# EAGLE design Sensor_LED_2x6_PCB (EAGLE 7.6.0)
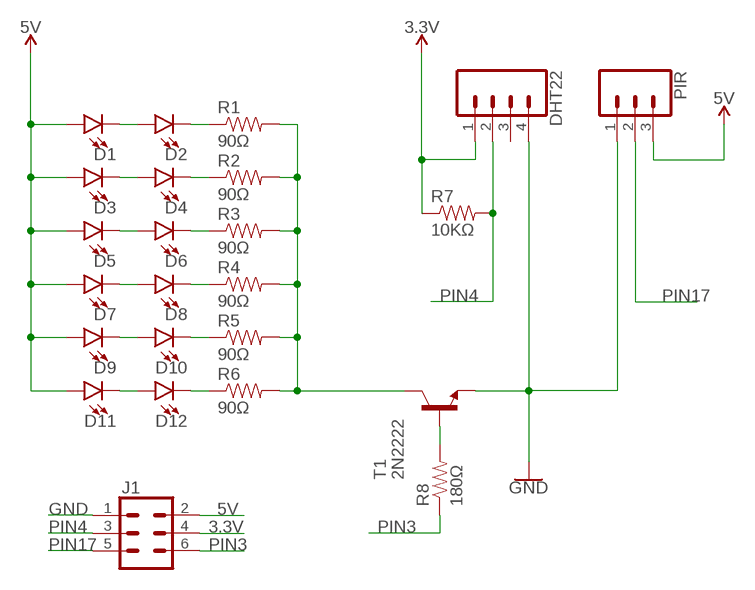
[diagram p0: schematic, sheet 1]

## Parts
D1  LED5MM  [LED_5MM]
D2  LED5MM  [LED_5MM]
D3  LED5MM  [LED_5MM]
D4  LED5MM  [LED_5MM]
D5  LED5MM  [LED_5MM]
D6  LED5MM  [LED_5MM]
D7  LED5MM  [LED_5MM]
D8  LED5MM  [LED_5MM]
D9  LED5MM  [LED_5MM]
D10  LED5MM  [LED_5MM]
D11  LED5MM  [LED_5MM]
D12  LED5MM  [LED_5MM]
DHT22  CONN_04LONGPADS  [1X04_LONGPADS]
J1  CONN_03X2SHROUD  [2X3-SHROUDED]
PIR  CONN_03LONGPADS  [1X03_LONGPADS]
R1  90Ω  RESISTOR1206  [1206]
R2  90Ω  RESISTOR1206  [1206]
R3  90Ω  RESISTOR1206  [1206]
R4  90Ω  RESISTOR1206  [1206]
R5  90Ω  RESISTOR1206  [1206]
R6  90Ω  RESISTOR1206  [1206]
R7  10KΩ  RESISTOR1206  [1206]
R8  180Ω  RESISTOR1206  [1206]
T1  2N2222  [TO92-EBC-OVAL]

## Nets
3.3V: DHT22.1 J1.4 R7.1
5V: D1.A D3.A D5.A D7.A D9.A D11.A J1.2 PIR.3
GND: DHT22.4 J1.1 PIR.1 T1.E
N$1: D1.K(C) D2.A
N$2: D3.K(C) D4.A
N$3: D5.K(C) D6.A
N$4: R8.2 T1.B
N$5: D7.K(C) D8.A
N$6: D12.K(C) R6.1
N$7: R1.2 R2.2 R3.2 R4.2 R5.2 R6.2 T1.C
N$8: D2.K(C) R1.1
N$11: D9.K(C) D10.A
N$12: D4.K(C) R2.1
N$13: D6.K(C) R3.1
N$14: D8.K(C) R4.1
N$15: D10.K(C) R5.1
N$18: D11.K(C) D12.A
PIN3: J1.6 R8.1
PIN4: DHT22.2 J1.3 R7.2
PIN17: J1.5 PIR.2
Unconnected: DHT22.3

## Library data of the parts
D1-D12 = SparkFun-LED:LED: LED (Generic) Standard schematic elements and footprints for 5mm, 3mm, 1206, and 0603 sized LEDs. Generic LEDs with no color specified.
DHT22 = SparkFun-Connectors:CONN_04: Multi connection point. Often used as Generic Header-pin footprint for 0.1 inch spaced/style header connections On any of the 0.1 inch spaced packages, you can populate with these: Break Away Headers - Straight <https://www.sparkfun.com/products/116> (PRT-00116) Break Away Male Headers - Right Angle <https://www.sparkfun.com/products/553> (PRT-00553) Female Headers <https://www.sparkfun.com/products/115> (PRT-00115) Break Away Headers - Machine Pin <https://www.sparkfun.com/products/117> (PRT-00117) Break Away Female Headers - Swiss Machine Pin <https://www.sparkfun.com/products/743> (PRT-00743) For SCREWTERMINALS and SPRING TERMINALS visit here: Screw Terimnals on SparkFun.com <https://www.sparkfun.com/search/results?term=Screw+Terminals> (5mm/3.5mm/2.54mm spacing) This device is also useful as a general connection point to wire up your design to another part of your project. Our various solder wires solder well into these plated through hole pads. Hook-Up Wire - Assortment (Stranded, 22 AWG) <https://www.sparkfun.com/products/11375> (PRT-11375) Hook-Up Wire - Assortment (Solid Core, 22 AWG) <https://www.sparkfun.com/products/11367> (PRT-11367) View the entire wire category on our website here <https://www.sparkfun.com/categories/141> Special notes: Molex polarized connector foot print use with SKU : PRT-08231 with associated crimp pins and housings. 1MM SMD Version SKU: PRT-10208; PROD_ID: CONN-09696
J1 = SparkFun-Connectors:CONN_03X2: Multi connection point. Often used as Generic Header-pin footprint for 0.1 inch spaced/style header connections You can populate with any combo of single row headers, but if you'd like an exact match, check these: Header - 2x3 (Male, 0.1") <https://www.sparkfun.com/products/12807> (PRT-12807) Header - 2x3 (Female, 0.1") <https://www.sparkfun.com/products/13010> (PRT-13010) 2x3 Pin Shrouded Header <https://www.sparkfun.com/products/10877> (PRT-10877) On any of the 0.1 inch spaced packages, you can populate with these: Break Away Headers - Straight <https://www.sparkfun.com/products/116> (PRT-00116) Break Away Male Headers - Right Angle <https://www.sparkfun.com/products/553> (PRT-00553) Female Headers <https://www.sparkfun.com/products/115> (PRT-00115) Break Away Headers - Machine Pin <https://www.sparkfun.com/products/117> (PRT-00117) Break Away Female Headers - Swiss Machine Pin <https://www.sparkfun.com/products/743> (PRT-00743) Special note: the shrouded connector mates well with our 3x2 ribbon cables: Ribbon Crimp Connector - 6-pin (2x3, Female) <https://www.sparkfun.com/products/10651> (PRT-10651) Ribbon Cable - 6 wire (15ft) <https://www.sparkfun.com/products/10646> (PRT-10646); PROD_ID: CONN-10681; SF_ID: PRT_10877
PIR = SparkFun-Connectors:CONN_03: Multi connection point. Often used as Generic Header-pin footprint for 0.1 inch spaced/style header connections On any of the 0.1 inch spaced packages, you can populate with these: Break Away Headers - Straight <https://www.sparkfun.com/products/116> (PRT-00116) Break Away Male Headers - Right Angle <https://www.sparkfun.com/products/553> (PRT-00553) Female Headers <https://www.sparkfun.com/products/115> (PRT-00115) Break Away Headers - Machine Pin <https://www.sparkfun.com/products/117> (PRT-00117) Break Away Female Headers - Swiss Machine Pin <https://www.sparkfun.com/products/743> (PRT-00743) Stackable Header - 3 Pin (Female, 0.1") <https://www.sparkfun.com/products/13875> (PRT-13875) For SCREWTERMINALS and SPRING TERMINALS visit here: Screw Terimnals on SparkFun.com <https://www.sparkfun.com/search/results?term=Screw+Terminals> (5mm/3.5mm/2.54mm spacing) This device is also useful as a general connection point to wire up your design to another part of your project. Our various solder wires solder well into these plated through hole pads. Hook-Up Wire - Assortment (Stranded, 22 AWG) <https://www.sparkfun.com/products/11375> (PRT-11375) Hook-Up Wire - Assortment (Solid Core, 22 AWG) <https://www.sparkfun.com/products/11367> (PRT-11367) View the entire wire category on our website here <https://www.sparkfun.com/categories/141> Special notes: Molex polarized connector foot print use with SKU : PRT-08232 with associated crimp pins and housings.
R1-R8 = SparkFun-Passives:RESISTOR: Resistor Basic schematic elements and footprints for 0603, 1206, and PTH resistors.
T1 = adafruit:2N2222: NPN TRANSISTOR Big oval pads

## Board
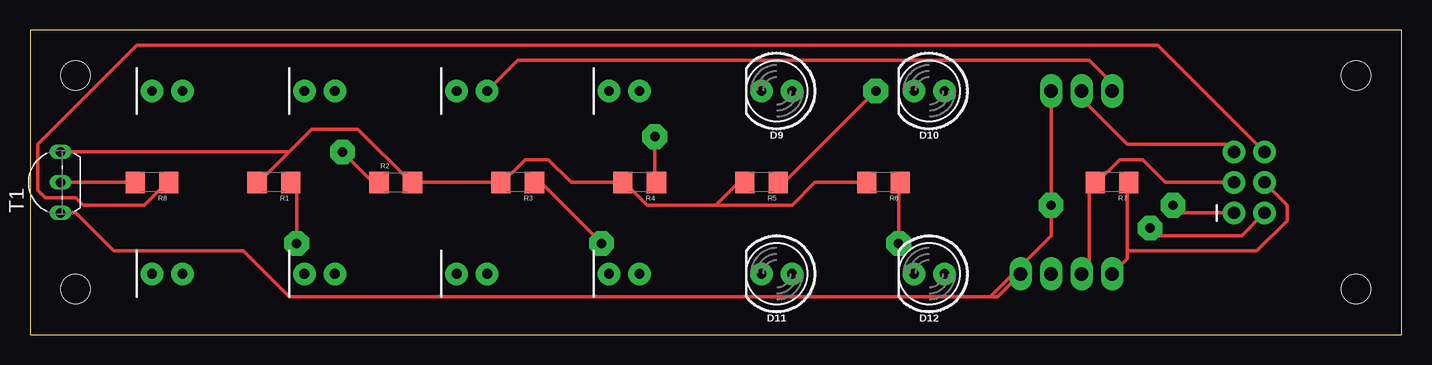
[diagram p1: board, top side]
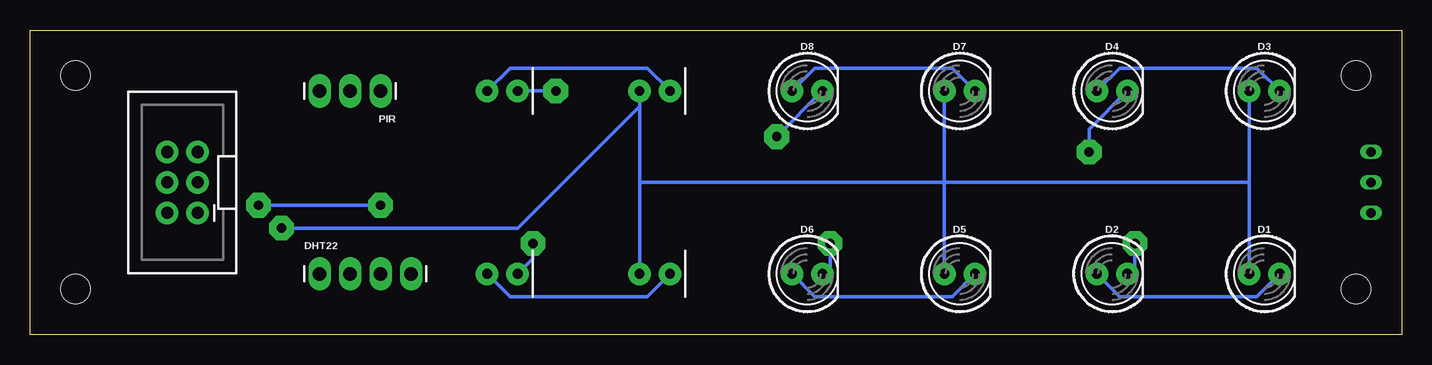
[diagram p2: board, bottom side, seen from below]

Size 114.3 x 25.4 mm. Coordinates in mm from the lower left corner, seen from the top.
Outline: 0,0 114.3,0 114.3,25.4 0,25.4 0,0
Copper layers (1*16): Top 0.035mm / dielectric 1.5mm / Bottom 0.035mm
Design rules "OthermillDRC_1_64_v2 *": minimum track width 12mil, minimum drill 31mil, track to track 0.39878125mm, track to pad 0.39878125mm, pad to pad 0.39878125mm, via to via 0.39878125mm, smd to smd 0mil, copper to edge 0mil, drill to drill 1mil, minimum pad ring 0mil, minimum via ring 25mil, stop-mask expansion 1mil, vias tented up to drill 30mil, thermal gap 10mil
Holes 2.44 mm at 110.49,21.59 3.81,3.81 3.81,21.59 110.49,3.81
tRestrict: area 47,3.8 to 52.1,6.3; area 8.9,19.1 to 14,21.6; area 59.7,19.1 to 64.8,21.6; area 47,19.1 to 52.1,21.6; area 72.4,19.1 to 77.5,21.6; area 34.3,3.8 to 39.4,6.3; area 21.6,19.1 to 26.7,21.6; area 59.7,3.8 to 64.8,6.3; area 72.4,3.8 to 77.5,6.3; area 21.6,3.8 to 26.7,6.3; area 8.9,3.8 to 14,6.3; area 55.9,16.5 to 61,19.1
bRestrict: area 99.1,8.9 to 104.1,16.5; area 1.3,8.9 to 3.8,16.5; area 83.8,19.1 to 91.4,21.6; area 81.3,3.8 to 91.4,6.3
vRestrict: area 96.5,5.1 to 106.7,20.3

### Footprints (pad centres in the part's own frame; a part is rotated, then mirrored left to right if it is on the bottom)
LED_5MM = drill 0.813 pad 1.88: A -1.27,0; K 1.27,0
1X04_LONGPADS = drill 1.118 pad 1.88 long: 1 0,0; 2 2.54,0; 3 5.08,0; 4 7.62,0
2X3-SHROUDED = drill 1.016 pad 1.88: 1 -1.27,2.54; 2 1.27,2.54; 3 -1.27,0; 4 1.27,0; 5 -1.27,-2.54; 6 1.27,-2.54
1X03_LONGPADS = drill 1.118 pad 1.88 long: 1 0,0; 2 2.54,0; 3 5.08,0
1206 = smd 1.6 x 1.8: 1 -1.4,0; 2 1.4,0
TO92-EBC-OVAL = drill 0.813 long: B 0,-1.27; C 2.54,-1.27; E -2.54,-1.27

### Placement (x,y rotation side)
D1  11.43,5.08 0 bottom
D2  24.13,5.08 0 bottom
D3  11.43,20.32 0 bottom
D4  24.13,20.32 0 bottom
D5  36.83,5.08 0 bottom
D6  49.53,5.08 0 bottom
D7  36.83,20.32 0 bottom
D8  49.53,20.32 0 bottom
D9  62.23,20.32 180 top
D10  74.93,20.32 180 top
D11  62.23,5.08 180 top
D12  74.93,5.08 180 top
DHT22  90.17,5.08 0 bottom
J1  101.6,12.7 180 bottom
PIR  85.09,20.32 180 bottom
R1  20.32,12.7 180 top
R2  30.48,12.7 0 top
R3  40.64,12.7 180 top
R4  50.8,12.7 180 top
R5  60.96,12.7 180 top
R6  71.12,12.7 180 top
R7  90.17,12.7 180 top
R8  10.16,12.7 180 top
T1  1.27,12.7 90 top

### Tracks (layer width: path | path; a pad name or v marks a point on that pad's centre or on a via)
3.3V
  Top 0.305: 91.44,6.99 91.44,6.35 DHT22.1 | 91.44,6.99 91.44,12.7 R7.1 | J1.4 104.78,10.79 104.78,9.53 102.23,6.99 91.44,6.99
5V  (via drill 0.79)
  Top 0.305: J1.2 100.97,8.26 93.98,8.26 v93.34,8.89 | PIR.3 90.17,20.95 88.27,22.86 40.64,22.86 D7.A
  Bottom 0.305: D9.A 63.5,19.05 | 63.5,19.05 63.5,12.7 | 63.5,12.7 D11.A | v93.34,8.89 73.66,8.89 63.5,19.05 | D3.A 12.7,12.7 | 12.7,12.7 D1.A | D7.A 38.1,12.7 | 38.1,12.7 D5.A | 38.1,12.7 12.7,12.7 | 38.1,12.7 63.5,12.7
GND  (via drill 0.79)
  Top 0.305: T1.E 3.81,10.16 6.99,6.99 17.78,6.99 21.59,3.17 80.01,3.17 | 80.01,3.17 80.64,3.17 DHT22.4 | PIR.1 v85.09,10.79 85.09,8.26 80.01,3.17 | J1.1 95.89,10.16 v95.25,10.79
  Bottom 0.305: v85.09,10.79 v95.25,10.79
N$1
  Bottom 0.305: D1.K 12.06,3.17 23.5,3.17 D2.A
N$2
  Bottom 0.305: D3.K 12.06,22.23 23.5,22.23 D4.A
N$3
  Bottom 0.305: D5.K 37.47,3.17 48.9,3.17 D6.A
N$4
  Top 0.305: T1.B R8.2
N$5
  Bottom 0.305: D7.K 37.47,22.23 48.9,22.23 D8.A
N$6  (via drill 0.79)
  Top 0.305: v72.39,7.62 72.39,12.7 R6.1
  Bottom 0.305: v72.39,7.62 72.39,6.35 D12.K
N$7
  Top 0.305: 57.15,10.79 51.44,10.79 49.53,12.7 R4.2 45.09,12.7 43.18,14.61 41.27,14.61 39.37,12.7 R3.2 R2.2 31.75,12.7 27.3,17.14 23.5,17.14 21.59,15.24 | 57.15,10.79 59.05,12.7 R5.2 | R6.2 65.41,12.7 63.5,10.79 57.15,10.79 | 21.59,15.24 19.05,12.7 R1.2 | 21.59,15.24 T1.C
N$8  (via drill 0.79)
  Top 0.305: v22.23,7.62 22.23,12.7 R1.1
  Bottom 0.305: v22.23,7.62 22.23,5.71 D2.K
N$11
  Bottom 0.305: D9.K 62.87,22.23 74.3,22.23 D10.A
N$12  (via drill 0.79)
  Top 0.305: v26.04,15.24 28.57,12.7 R2.1
  Bottom 0.305: v26.04,15.24 26.04,17.14 D4.K
N$13  (via drill 0.79)
  Top 0.305: v47.62,7.62 42.55,12.7 R3.1
  Bottom 0.305: v47.62,7.62 47.62,5.71 D6.K
N$14  (via drill 0.79)
  Top 0.305: v52.07,16.51 52.07,12.7 R4.1
  Bottom 0.305: D8.K v52.07,16.51
N$15  (via drill 0.79)
  Top 0.305: v70.48,20.32 62.87,12.7 R5.1
  Bottom 0.305: D10.K v70.48,20.32
N$18
  Bottom 0.305: D11.K 62.87,3.17 74.3,3.17 D12.A
PIN3
  Top 0.305: J1.6 93.98,24.13 8.89,24.13 0.64,15.88 0.64,12.06 1.27,11.43 3.81,11.43 4.45,10.79 9.53,10.79 11.43,12.7 R8.1
PIN4
  Top 0.305: DHT22.2 88.27,5.71 88.27,12.7 R7.2 88.9,12.7 90.81,14.61 92.71,14.61 94.61,12.7 J1.3
PIN17
  Top 0.305: PIR.2 87.63,19.68 91.44,15.88 99.69,15.88 J1.5